# Altium schematic sheet Sheet2.SchDoc
size B; SheetNumber: 1; SheetTotal: 1
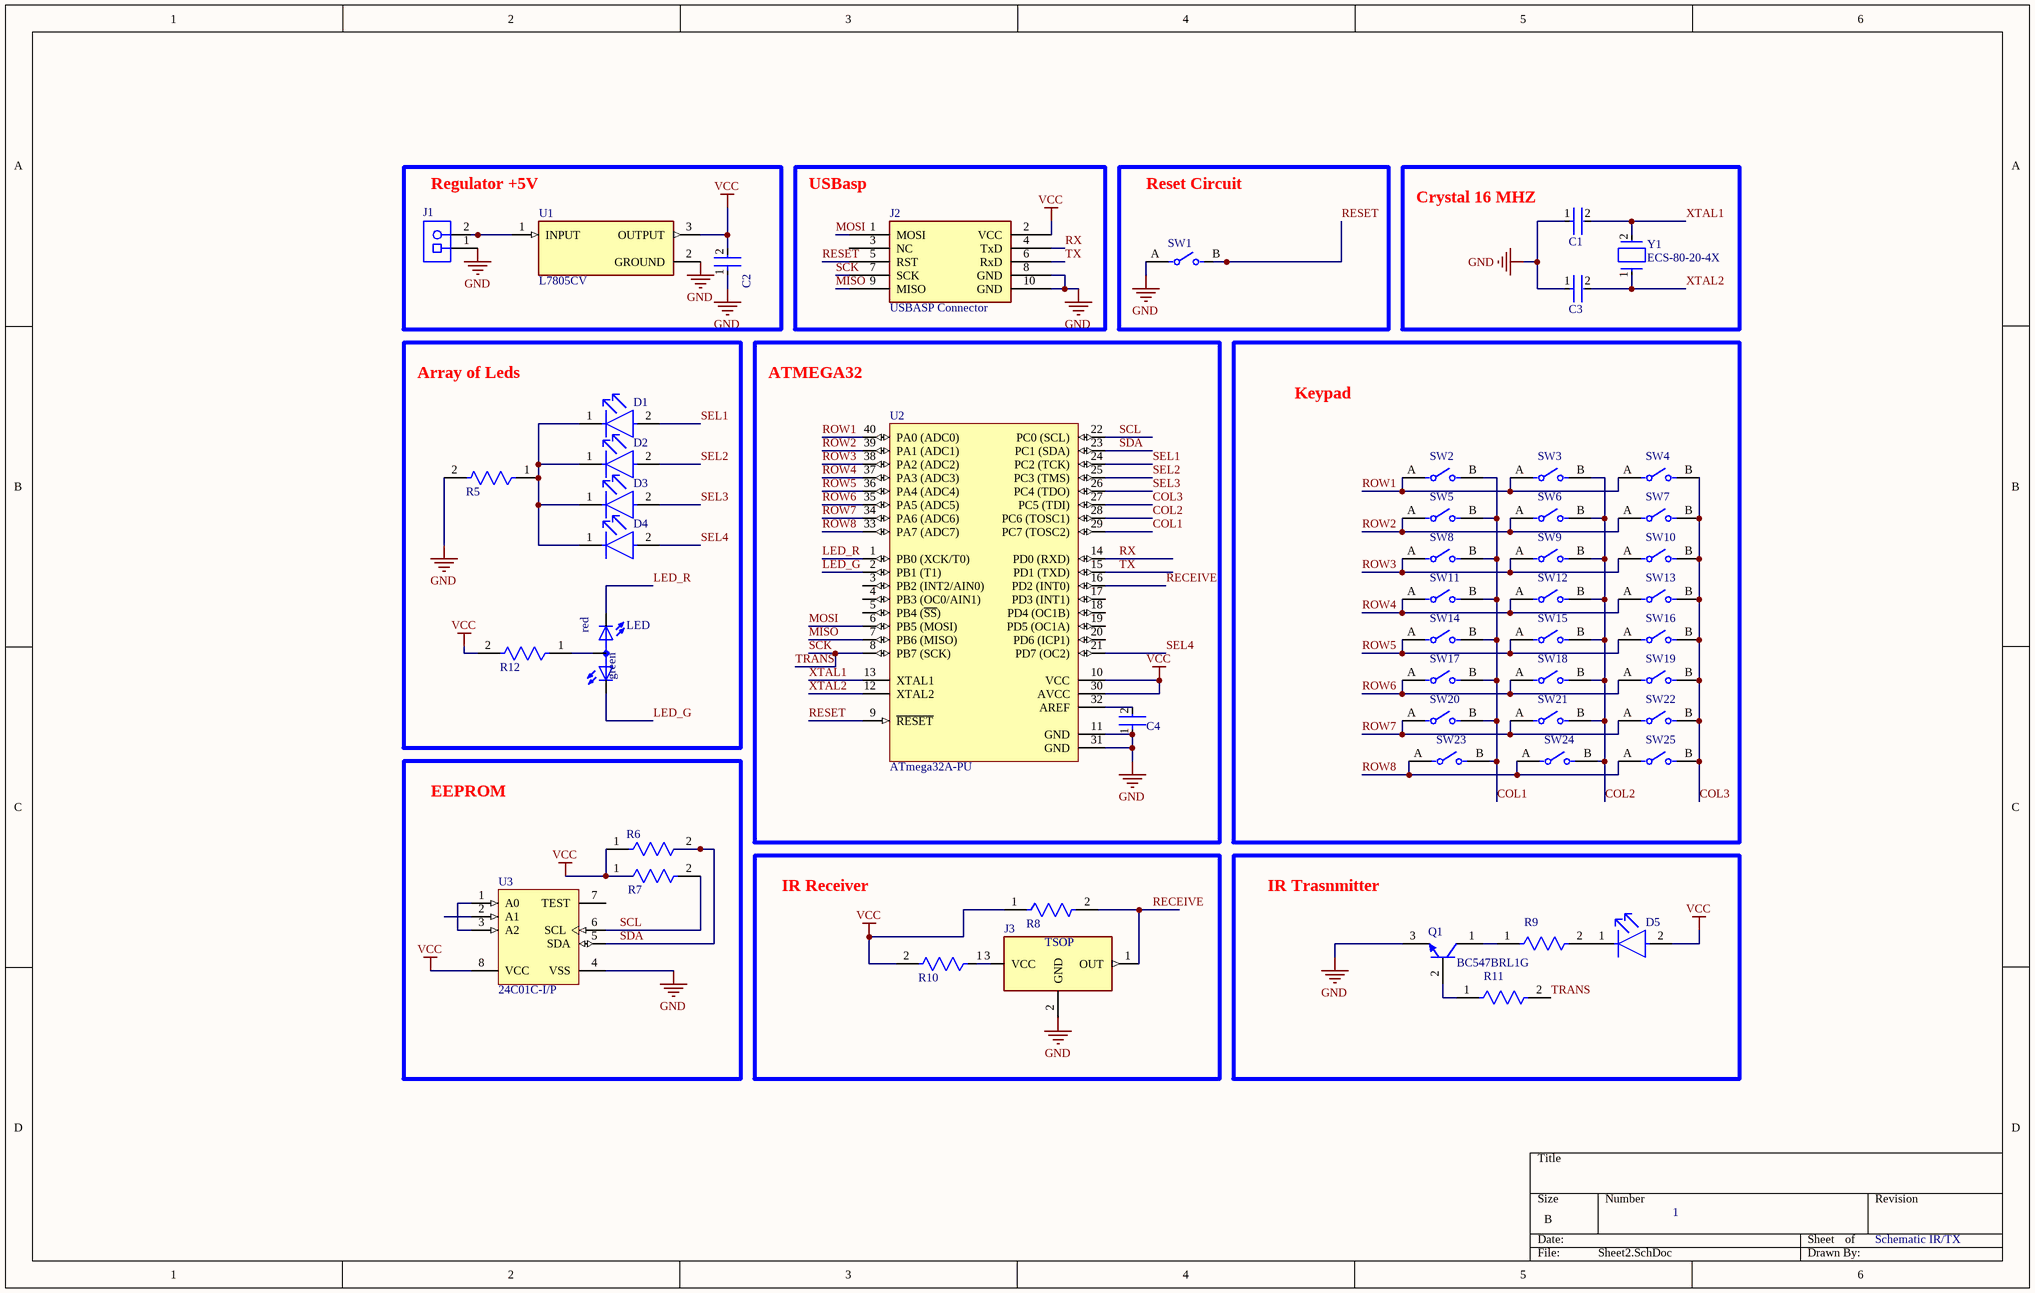
[diagram p0: Sheet2.SchDoc]

## Parts
C1  K103K15X7RF5TL2  [FP-K155L2-MFG]  (value not drawn)
C2  K103K15X7RF5TL2  [FP-K155L2-MFG]  (value not drawn)
C3  K103K15X7RF5TL2  [FP-K155L2-MFG]  (value not drawn)
C4  K103K15X7RF5TL2  [FP-K155L2-MFG]  (value not drawn)
D1  TLLG4401  [FP-6_544-5255_01-4-MFG]  (value not drawn)
D2  TLLG4401  [FP-6_544-5255_01-4-MFG]  (value not drawn)
D3  TLLG4401  [FP-6_544-5255_01-4-MFG]  (value not drawn)
D4  TLLG4401  [FP-6_544-5255_01-4-MFG]  (value not drawn)
D5  TLLG4401  [FP-6_544-5255_01-4-MFG]  (value not drawn)
J1  1729128  [PHOE-1729128-2_V]  (value not drawn)
J2  USBASP Connector  [SHDR10W99P254_2X5_2032X889X927P]
J3  TSOP1838  [TSOP1838]  (value not drawn)
LED  L-59EGW-CA  [L-59EGW-CA]  (value not drawn)
Q1  BC547BRL1G  [ONSC-TO-92-3-29-11_AM_BL]
R5  MRS25000C1001FCT00  [FP-MRS25-MFG]  (value not drawn)
R6  MRS25000C1001FCT00  [FP-MRS25-MFG]  (value not drawn)
R7  MRS25000C1001FCT00  [FP-MRS25-MFG]  (value not drawn)
R8  MRS25000C1001FCT00  [FP-MRS25-MFG]  (value not drawn)
R9  MRS25000C1001FCT00  [FP-MRS25-MFG]  (value not drawn)
R10  MRS25000C1001FCT00  [FP-MRS25-MFG]  (value not drawn)
R11  MRS25000C1001FCT00  [FP-MRS25-MFG]  (value not drawn)
R12  MRS25000C1001FCT00  [FP-MRS25-MFG]  (value not drawn)
SW1  EVQ-21505R  [FP-EVQ-21505R-MFG]  (value not drawn)
SW2  EVQ-21505R  [FP-EVQ-21505R-MFG]  (value not drawn)
SW3  EVQ-21505R  [FP-EVQ-21505R-MFG]  (value not drawn)
SW4  EVQ-21505R  [FP-EVQ-21505R-MFG]  (value not drawn)
SW5  EVQ-21505R  [FP-EVQ-21505R-MFG]  (value not drawn)
SW6  EVQ-21505R  [FP-EVQ-21505R-MFG]  (value not drawn)
SW7  EVQ-21505R  [FP-EVQ-21505R-MFG]  (value not drawn)
SW8  EVQ-21505R  [FP-EVQ-21505R-MFG]  (value not drawn)
SW9  EVQ-21505R  [FP-EVQ-21505R-MFG]  (value not drawn)
SW10  EVQ-21505R  [FP-EVQ-21505R-MFG]  (value not drawn)
SW11  EVQ-21505R  [FP-EVQ-21505R-MFG]  (value not drawn)
SW12  EVQ-21505R  [FP-EVQ-21505R-MFG]  (value not drawn)
SW13  EVQ-21505R  [FP-EVQ-21505R-MFG]  (value not drawn)
SW14  EVQ-21505R  [FP-EVQ-21505R-MFG]  (value not drawn)
SW15  EVQ-21505R  [FP-EVQ-21505R-MFG]  (value not drawn)
SW16  EVQ-21505R  [FP-EVQ-21505R-MFG]  (value not drawn)
SW17  EVQ-21505R  [FP-EVQ-21505R-MFG]  (value not drawn)
SW18  EVQ-21505R  [FP-EVQ-21505R-MFG]  (value not drawn)
SW19  EVQ-21505R  [FP-EVQ-21505R-MFG]  (value not drawn)
SW20  EVQ-21505R  [FP-EVQ-21505R-MFG]  (value not drawn)
SW21  EVQ-21505R  [FP-EVQ-21505R-MFG]  (value not drawn)
SW22  EVQ-21505R  [FP-EVQ-21505R-MFG]  (value not drawn)
SW23  EVQ-21505R  [FP-EVQ-21505R-MFG]  (value not drawn)
SW24  EVQ-21505R  [FP-EVQ-21505R-MFG]  (value not drawn)
SW25  EVQ-21505R  [FP-EVQ-21505R-MFG]  (value not drawn)
U1  L7805CV  [TO255P1040X460X1968-3]
U2  ATmega32A-PU  [40P6]
U3  24C01C-I/P  [PDIP300-P8]
Y1  ECS-80-20-4X  [FP-ECS-80-20-4X-MFG]

## Blocks framed on the sheet
Regulator +5V: C2 J1 U1
USBasp: J2
Reset Circuit: SW1
Crystal 16 MHZ: C1 C3 Y1
Array of Leds: D1-D4 LED R5 R12
ATMEGA32: C4 U2
Keypad: SW2-SW25
EEPROM: R6 R7 U3
IR Receiver: J3 R8 R10
IR Trasnmitter: D5 Q1 R9 R11

## Nets
GND: C1.1 C2.1 C3.1 C4.1 J1.1 J2.8(GND) J2.10(GND) J3.2(GND) Q1.3(E) R5.2 SW1.A U1.2(GROUND) U2.11(GND) U2.31(GND) U3.4(VSS)
VCC: C2.2 D5.2(A) J2.2(VCC) R6.1 R7.1 R8.1 R10.2 R12.2 U1.3(OUTPUT) U2.10(VCC) U2.30(AVCC) U3.8(VCC)
COL1: SW2.B SW5.B SW8.B SW11.B SW14.B SW17.B SW20.B SW23.B U2.29(PC7_(TOSC2))
COL2: SW3.B SW6.B SW9.B SW12.B SW15.B SW18.B SW21.B SW24.B U2.28(PC6_(TOSC1))
COL3: SW4.B SW7.B SW10.B SW13.B SW16.B SW19.B SW22.B SW25.B U2.27(PC5_(TDI))
LED_G: LED.3(CG) U2.2(PB1_(T1))
LED_R: LED.1(CR) U2.1(PB0_(XCK/T0))
MISO: J2.9(MISO) U2.7(PB6_(MISO))
MOSI: J2.1(MOSI) U2.6(PB5_(MOSI))
RECEIVE: J3.1(OUT) R8.2 U2.16(PD2_(INT0))
RESET: J2.5(RST) SW1.B U2.9(~{RESET})
ROW1: SW2.A SW3.A SW4.A U2.40(PA0_(ADC0))
ROW2: SW5.A SW6.A SW7.A U2.39(PA1_(ADC1))
ROW3: SW8.A SW9.A SW10.A U2.38(PA2_(ADC2))
ROW4: SW11.A SW12.A SW13.A U2.37(PA3_(ADC3))
ROW5: SW14.A SW15.A SW16.A U2.36(PA4_(ADC4))
ROW6: SW17.A SW18.A SW19.A U2.35(PA5_(ADC5))
ROW7: SW20.A SW21.A SW22.A U2.34(PA6_(ADC6))
ROW8: SW23.A SW24.A SW25.A U2.33(PA7_(ADC7))
RX: J2.4(TxD) U2.14(PD0_(RXD))
SCK: J2.7(SCK) R11.2 U2.8(PB7_(SCK))  [also labelled TRANS]
SCL: R7.2 U2.22(PC0_(SCL)) U3.6(SCL)
SDA: R6.2 U2.23(PC1_(SDA)) U3.5(SDA)
SEL1: D1.2(A) U2.24(PC2_(TCK))
SEL2: D2.2(A) U2.25(PC3_(TMS))
SEL3: D3.2(A) U2.26(PC4_(TDO))
SEL4: D4.2(A) U2.21(PD7_(OC2))
TX: J2.6(RxD) U2.15(PD1_(TXD))
XTAL1: C1.2 U2.13(XTAL1) Y1.2
XTAL2: C3.2 U2.12(XTAL2) Y1.1
NetC4_2: C4.2 U2.32(AREF)
NetD1_1: D1.1(C) D2.1(C) D3.1(C) D4.1(C) R5.1
NetD5_1: D5.1(C) R9.2
NetJ1_2: J1.2 U1.1(INPUT)
NetJ3_3: J3.3(VCC) R10.1
NetLED_2: LED.2(A) R12.1
NetQ1_1: Q1.1(C) R9.1
NetQ1_2: Q1.2(B) R11.1
NetU3_1: U3.1(A0) U3.3(A2)

Not connected (* = marked no-connect by the designer): J2 3(NC); U2 3(PB2_(INT2/AIN0)) 4(PB3_(OC0/AIN1)) 5(PB4_(~{SS})) 17(PD3_(INT1)) 18(PD4_(OC1B)) 19(PD5_(OC1A)) 20(PD6_(ICP1)); U3 2(A1) 7(TEST)

## Notes on the sheet
- 1
- Schematic IR/TX
- (in symbol L-59EGW-CA) red; green
- (in symbol TSOP1838) TSOP

## Library data of the parts
C1 C3 = CMP-00030-39474934-1: K103K15X7RF5TL2 Multilayer Ceramic Capacitor, 0.01 uF, 50 V, ± 10%, X7R, Radial Leaded (10P); Voltage: 50V; Lead/Base Style: Straight; Lead Diameter: 500µm; Capacitance: 10nF; Lead Length: 30mm; Case/Package: Dipped; Weight: 160.004709mg; Thickness: 2.6mm; Lead Free: Lead Free; Width: 2.5mm; Min Operating Temperature: -55°C; Lead Pitch: 2.5mm; Voltage Rating: 50V; Dielectric: X7R; Schedule B: 8532240060; Dielectric Material: Ceramic; Number of Pins: 2; Tolerance: 10%; NexarPartId: 39474934; Termination: Radial; Length: 4mm; Radiation Hardening: No; Mount: PCB, Through Hole; Height: 4mm; Diameter: 500µm; Packaging: Cut Tape; Voltage Rating (DC): 50V; Max Operating Temperature: 125°C; REACH SVHC: Unknown; Depth: 2.6mm; RoHS: Compliant; Height - Seated (Max): 5.588mm
C2 C4 = CMP-00030-39474934-1: K103K15X7RF5TL2 Multilayer Ceramic Capacitor, 0.01 uF, 50 V, ± 10%, X7R, Radial Leaded; Voltage: 50V; Lead/Base Style: Straight; Lead Diameter: 500µm; Capacitance: 10nF; Lead Length: 30mm; Case/Package: Dipped; Weight: 160.004709mg; Thickness: 2.6mm; Lead Free: Lead Free; Width: 2.5mm; Min Operating Temperature: -55°C; Lead Pitch: 2.5mm; Voltage Rating: 50V; Dielectric: X7R; Schedule B: 8532240060; Dielectric Material: Ceramic; Number of Pins: 2; Tolerance: 10%; NexarPartId: 39474934; Termination: Radial; Length: 4mm; Radiation Hardening: No; Mount: PCB, Through Hole; Height: 4mm; Diameter: 500µm; Packaging: Cut Tape; Voltage Rating (DC): 50V; Max Operating Temperature: 125°C; REACH SVHC: Unknown; Depth: 2.6mm; RoHS: Compliant; Height - Seated (Max): 5.588mm
D1-D5 = CMP-00030-39390728-1: TLLG4401 LED, Green, 2mcd, 3mmDia., T-1, +/-25deg, 565nm, 7mA, 1.9V Vf, 20V Vr, 20mW, -40; Test Current: 2mA; Wavelength: 575nm; Number of Elements: 1; Viewing Angle: 25°; Lens Transparency: Diffused; Voltage Rating (DC): 2.4V; Lead Length: 23mm; Max Junction Temperature (Tj): 100°C; Lens Style: Circular, Colored, Diffused, Dome, Round, Tinted; Reverse Voltage: 6V; Forward Voltage: 1.9V; Length: 3.2mm; Forward Current: 2mA; Color: Green; Dominant Wavelength: 575nm; Radiation Hardening: No; NexarPartId: 39390728; Lens Color: Green; REACH SVHC: Unknown; Lead Free: Lead Free; Number of Pins: 2; Luminous Intensity: 2mcd; Schedule B: 8541402000, 8541402000; Max Operating Temperature: 100°C; Illumination Color: Green; Mount: Through Hole; Packaging: Bulk; Depth: 3.2mm; Ambient Temperature Range High: 100°C; Case/Package: Radial; Power Dissipation: 20mW; Height: 4.5mm; RoHS: Compliant; Peak Wavelength: 565nm; Min Operating Temperature: -40°C; Number of LEDs: 1
J1 = CMP-2000-05815-1: Header of  Input Batt; Manufacturer: Phoenix Contact; Package Version: 03/2015; No. of Rows: 1; Pitch: 5.08mm; No. of Positions: 2; Voltage Rating: 400V; Current Rating: 13500mA; Packing: Bulk; Manufacturer URL: http://www.phoenixcontact.com/; Datasheet URL: https://datasheet.ciiva.com/16046/1729128-16046181.pdf; RoHS: TRUE; Package URL: https://www.phoenixcontact.com/online/portal/pi/pxc/product_detail_page/!ut/p/b1/3VdJjqNKFDxLH8AFycySyWY2ozFsEPOMMQaDOX1XedGL_1Vdm5YXJleknhSKeBkvI6EA8ncAo3AYoDhBQGco6KN7VURTdemj9us_IEKEZo_YHiPAEWEFmDGOHMORkqKYCORBZxgL7ZoaZYcbFFUZ3fqxSY6GOuxydWUuHqz1ynmMFygu583Bob0Ewr6Sd_l-5m-kAueHiB0jpRwZwe58wwtkpxtMYd_LmGcDRU02dRNEyWt6Y2ti5pSyJ_reIkzIulrqApdnbT11V5jnCKbYNCvhEM1MCpPByat_X379-iThf08CI5GfOPqfBeS3BRoBOdD55AKVv0iLwCMq-2BrzXWSGRH7pUGD9uwXQjiph3xL0DKQwdGa0JImiIOmBNOestqgwTHSSs2oOep-78apyXQBvNi8ZLaFjvjWvcaUEBu0MC6Wbe-d6mB0FAebo2lUWinqYaZs5DAYzV0RP9yitUjnGJ0iI9xhZkT42OCQNUJJhkgWINNQLP2JFP6OpMg3JCVg70jqHT0lvKOnhHf0lPuOnnLf0VPuWx6_dxwUIvwk5WMkT0kLL1mh61l2yZVSzG3pYV_bqo-mj6uMKwKwdnnW8Jh5RTOJzMOA5c-eJDaZQw4mTMPH02PvS_ZAqNVjVTo2WyYLkwH_KU1mmmG5kjRhDqPXLwwVHvVOjCM60-fpXvTDfMGW1PVFVS1r4e4yVDk4ZdNbkUHvqPqQSeian4UD39fNKmachqdJ1NJbyk8rXT9mXTvPk3oE5meulKGgiruPJek-4I9hTT6G8ZLOyRSm2RRVbThERQad5OS28hdt4YW4vG0stgYYzsWsK4_7y6DZMjJSCqri1kyiZR5vD7pwIrNR7QwPHTcLTI5qT7eRlpHrdGiupYlqQDJ7zy_CND8fWWBoLRXxk1RVcXiBQwbTD4Xi7KL-FuO94t9xaqweXzH; PartNumber: 1729128; Package Description: 2-Pin Through Hole Device, Body 8.1 x 10.16 mm, Pitch 5.08 mm; Datasheet Version: 12/2013; Mounting Technology: ThroughHole; Orientation: Horizontal; Package Reference: 1729128-2
J2 = USBASP Connector: Connector; Manufacturer_Name: Molex; Manufacturer_Part_Number: 70246-1001; Datasheet Link: http://www.molex.com/pdm_docs/sd/702461001_sd.pdf; Height: 9.27mm; Mouser Part Number: 538-70246-1001; Mouser Price/Stock: https://www.mouser.co.uk/ProductDetail/Molex/70246-1001?qs=L7RdmAxh%252BcP9d7Ope9dnAA%3D%3D
J3 = TSOP1838: IR Remote Receiver 38KHz 35m 3-Pin; MF: Vishay; SnapEDA_Link: https://www.snapeda.com/parts/TSOP1838/Vishay/view-part/?ref=snap; Package: None; Value: *; MP: TSOP1838; Check_prices: https://www.snapeda.com/parts/TSOP1838/Vishay/view-part/?ref=eda
LED = L-59EGW-CA: LED; 5mm; bicolour; red/green; 5mcd; 5mcd; 60Â°; Front: convex; anode; MF: Kingbright; Package: None; Value: *; Availability: Unavailable; SnapEDA_Link: https://www.snapeda.com/parts/L-59EGW-CA/Kingbright/view-part/885747/?ref=snap; Price: None; MP: L-59EGW-CA
Q1 = CMP-1048-01605-1: Amplifier Transistor, NPN Silicon, 3-Pin TO-92, Pb-Free, Tape and Reel; Manufacturer: On Semiconductor; IC Continuous (A): 0.1; fT Min (MHz): 150; ComponentLink2URL: http://www.onsemi.com/pub_link/Collateral/BC546-D.PDF; ComponentLink1URL: http://www.onsemi.com/; ComponentLink2Description: Datasheet; RoHS: TRUE; ComponentLink3Description: Package Specification; ComponentLink1Description: Manufacturer URL; ComponentLink3URL: http://www.onsemi.com/pub_link/Collateral/MAC97-D.PDF; PackageDescription: 3-Pin Transistor Outline, Body 4.825 x 3.685 mm, Pitch 1.27 mm; Packing: Tape and Reel; PackageVersion: Rev. AM; Polarity: NPN; DatasheetVersion: Rev. 7; Mounting Technology: Through Hole; PackageReference: TO-92-3-29-11_AM_BL; PartNumber: BC547BRL1G
R5-R8 R11 R12 = CMP-02408-000051-1: RES 1K OHM 0.6W 1% AXIAL; Power Rating: 600mW; Lead Diameter: 0.6mm; Voltage Rating (DC): 350V; Resistance: 1kR; Temperature Coefficient: 50ppm/°C; Width: 2.5mm; Military Standard: Not; Package Quantity: 5000; Radiation Hardening: No; Case/Package: Axial; Resistance Tolerance: 1%; Resistor Type: Metal Film; Contact Plating: Tin; Length: 6.5mm; Lead Free: Lead Free; RoHS Compliant: Yes; Mount: Through Hole; Number of Pins: 2; Technology: THIN FILM; Voltage Rating: 350V; Min Operating Temperature: -55°C; Weight: 0.00776oz; Diameter: 2.5mm; Construction: Cylindrical; Series: MRS25; Tolerance: 1%; Packaging: Tape and Reel; Max Operating Temperature: 155°C; Max Power Dissipation: 600mW; Number of Terminations: 2; Termination: Axial
R9 R10 = CMP-02408-000051-1: RES 100 OHM 0.6W 1% AXIAL; Power Rating: 600mW; Lead Diameter: 0.6mm; Voltage Rating (DC): 350V; Resistance: 1kR; Temperature Coefficient: 50ppm/°C; Width: 2.5mm; Military Standard: Not; Package Quantity: 5000; Radiation Hardening: No; Case/Package: Axial; Resistance Tolerance: 1%; Resistor Type: Metal Film; Contact Plating: Tin; Length: 6.5mm; Lead Free: Lead Free; RoHS Compliant: Yes; Mount: Through Hole; Number of Pins: 2; Technology: THIN FILM; Voltage Rating: 350V; Min Operating Temperature: -55°C; Weight: 0.00776oz; Diameter: 2.5mm; Construction: Cylindrical; Series: MRS25; Tolerance: 1%; Packaging: Tape and Reel; Max Operating Temperature: 155°C; Max Power Dissipation: 600mW; Number of Terminations: 2; Termination: Axial
SW1-SW25 = CMP-05618-000118-1: SWITCH TACTILE SPST-NO 0.02A 15V; Actuator Length: 1.6mm; Contact Current Rating: 20mA; Actuator Type: Standard; Operating Force: 1.6N; Switch Function: Off-Mom; Mechanical Life: 100000Cycles; Illumination Type: Non-Illuminated; Contact Resistance: 50mR; Actuator Color: Red; Throw Configuration: SPST; Switch Travel: 0.25mm; Termination: PC Pin; Package Quantity: 1; Lead Free: Lead Free; Orientation: Straight; Packaging: Tape and Reel; Series: EVQ2; Min Operating Temperature: -20°C; Max Operating Temperature: 70°C; Width: 6mm; Voltage Rating (DC): 15V; Current Rating: 20mA; Depth: 6mm; Height: 5mm; Contact Plating: Silver; Electrical Life: 100000Cycles; Mount: Through Hole; Max Voltage Rating (DC): 15V; Max Current Rating: 20mA; Length: 6mm; Size: 6mm; Case/Package: Radial
U1 = L7805CV: Linear Voltage Regulator IC Positive Fixed 1 Output 1.5A TO-220; MF: STMicroelectronics; SnapEDA_Link: https://www.snapeda.com/parts/L7805CV/STMicroelectronics/view-part/?ref=snap; Package: TO-220-3 ON Semiconductor; MP: L7805CV; Check_prices: https://www.snapeda.com/parts/L7805CV/STMicroelectronics/view-part/?ref=eda; Purchase-URL: https://pricing.snapeda.com/search/part/L7805CV/?ref=eda; Price: None; Value: *; Availability: In Stock
U2 = CMP-0095-00028-2: 8-bit AVR Microcontroller, 2.7-5.5V, 16MHz, 32KB Flash, 1KB EEPROM, 2KB SRAM, 40-pin PDIP, Industrial Grade (-40°C to 85°C); Code_JEDEC: MS-011-AC; ComponentLink3Description: ATmega32A Summary; PackageVersion: revB, Sep-2001; ComponentLink2Description: ATmega32A Datasheet; ComponentLink3URL: http://www.atmel.com/dyn/resources/prod_documents/8155S.pdf; PackageDescription: 40-lead (0.600"/15.24mm Wide) Plastic Dual Inline Package (PDIP); ComponentLink1Description: Manufacturer URL; PackageReference: 40P6; DatasheetVersion: revC, Feb-2011; ComponentLink2URL: http://www.atmel.com/dyn/resources/prod_documents/doc8155.pdf; RevisionNote: DatasheetVersion updated. URLs added.; ComponentLink1URL: http://www.atmel.com/
U3 = CMP-0159-00085-1: 1Kbit, 400kHz, 5V, I2C Serial EEPROM, 8-Pin PDIP, Industrial Temperature; PackageReference: PDIP300-P8; Code_JEDEC: MS-001; DatasheetVersion: revJ, Aug-2008; PackageDescription: 8-Lead Plastic Dual In-Line (P) - 300 mil Body [PDIP]; PackageVersion: revBB, Aug-2009
Y1 = CMP-1669-00002-3: NexarPartId: 316504; Frequency Stability: 50ppm; ESR (Equivalent Series Resistance): 80Ω; Frequency: 8MHz; Tolerance: 0.003%; Load Capacitance: 20pF; Schedule B: 8541600025, 8541600025; Number of Pins: 49; Max Operating Temperature: 70°C; Lead Free: Lead Free; Height: 3.5mm; Termination: Radial; RoHS: Compliant; Frequency Tolerance: 0.003%; Packaging: Bulk; Mount: Through Hole; Width: 4.65mm; Length: 11.3538mm; Min Operating Temperature: -10°C